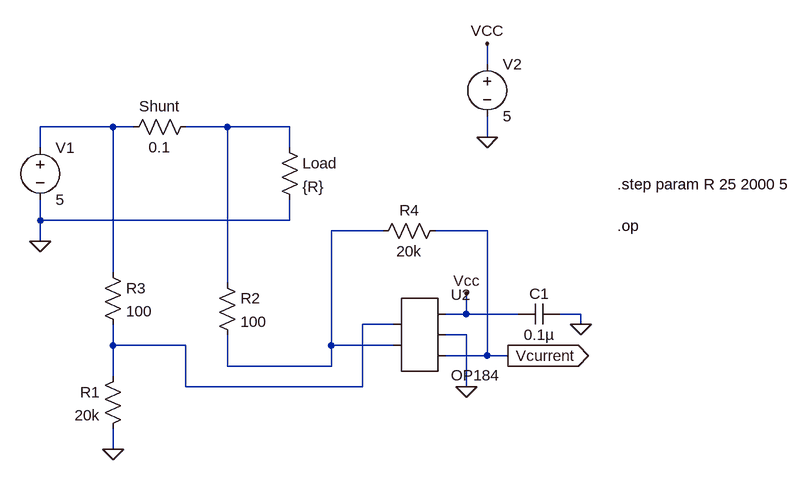
[diagram p0: schematic Draft1.asc]
* Draft1.asc
R§Shunt N002 N001 0.1
V1 N001 0 5
R§Load N002 0 {R}
C1 0 Vcc 0.1µ
R1 N004 0 20k
R2 N002 N003 100
R3 N001 N004 100
R4 Vcurrent N003 20k
* U2: OP184 (symbol AutoGenerated\OP184 not available, pins judged from their places): pin1=N004 pin2=N003 pin3=Vcc pin4=0 pin5=Vcurrent
V2 Vcc 0 5
.op
.step param R 25 2000 5
.backanno
.end

* Results of the author's LTspice run, read from the files saved beside the schematic
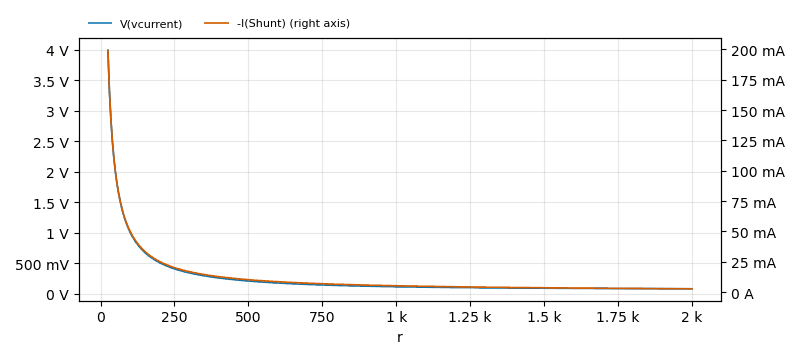
[diagram p1: Operating Point of Draft1.asc, plotted from the saved traces]
* Operating Point, 1 run:
*   V(vcurrent): 3.991 V at r=25 , 83.53 mV at r=2 k, min 83.53 mV, max 3.991 V
*   -I(Shunt): 199.3 mA at r=25 , 2.745 mA at r=2 k, min 2.745 mA, max 199.3 mA